# EAGLE design lm3410-sepic-flashlight-driver-17mm-mk-1.0.1 (EAGLE 6.6.0)
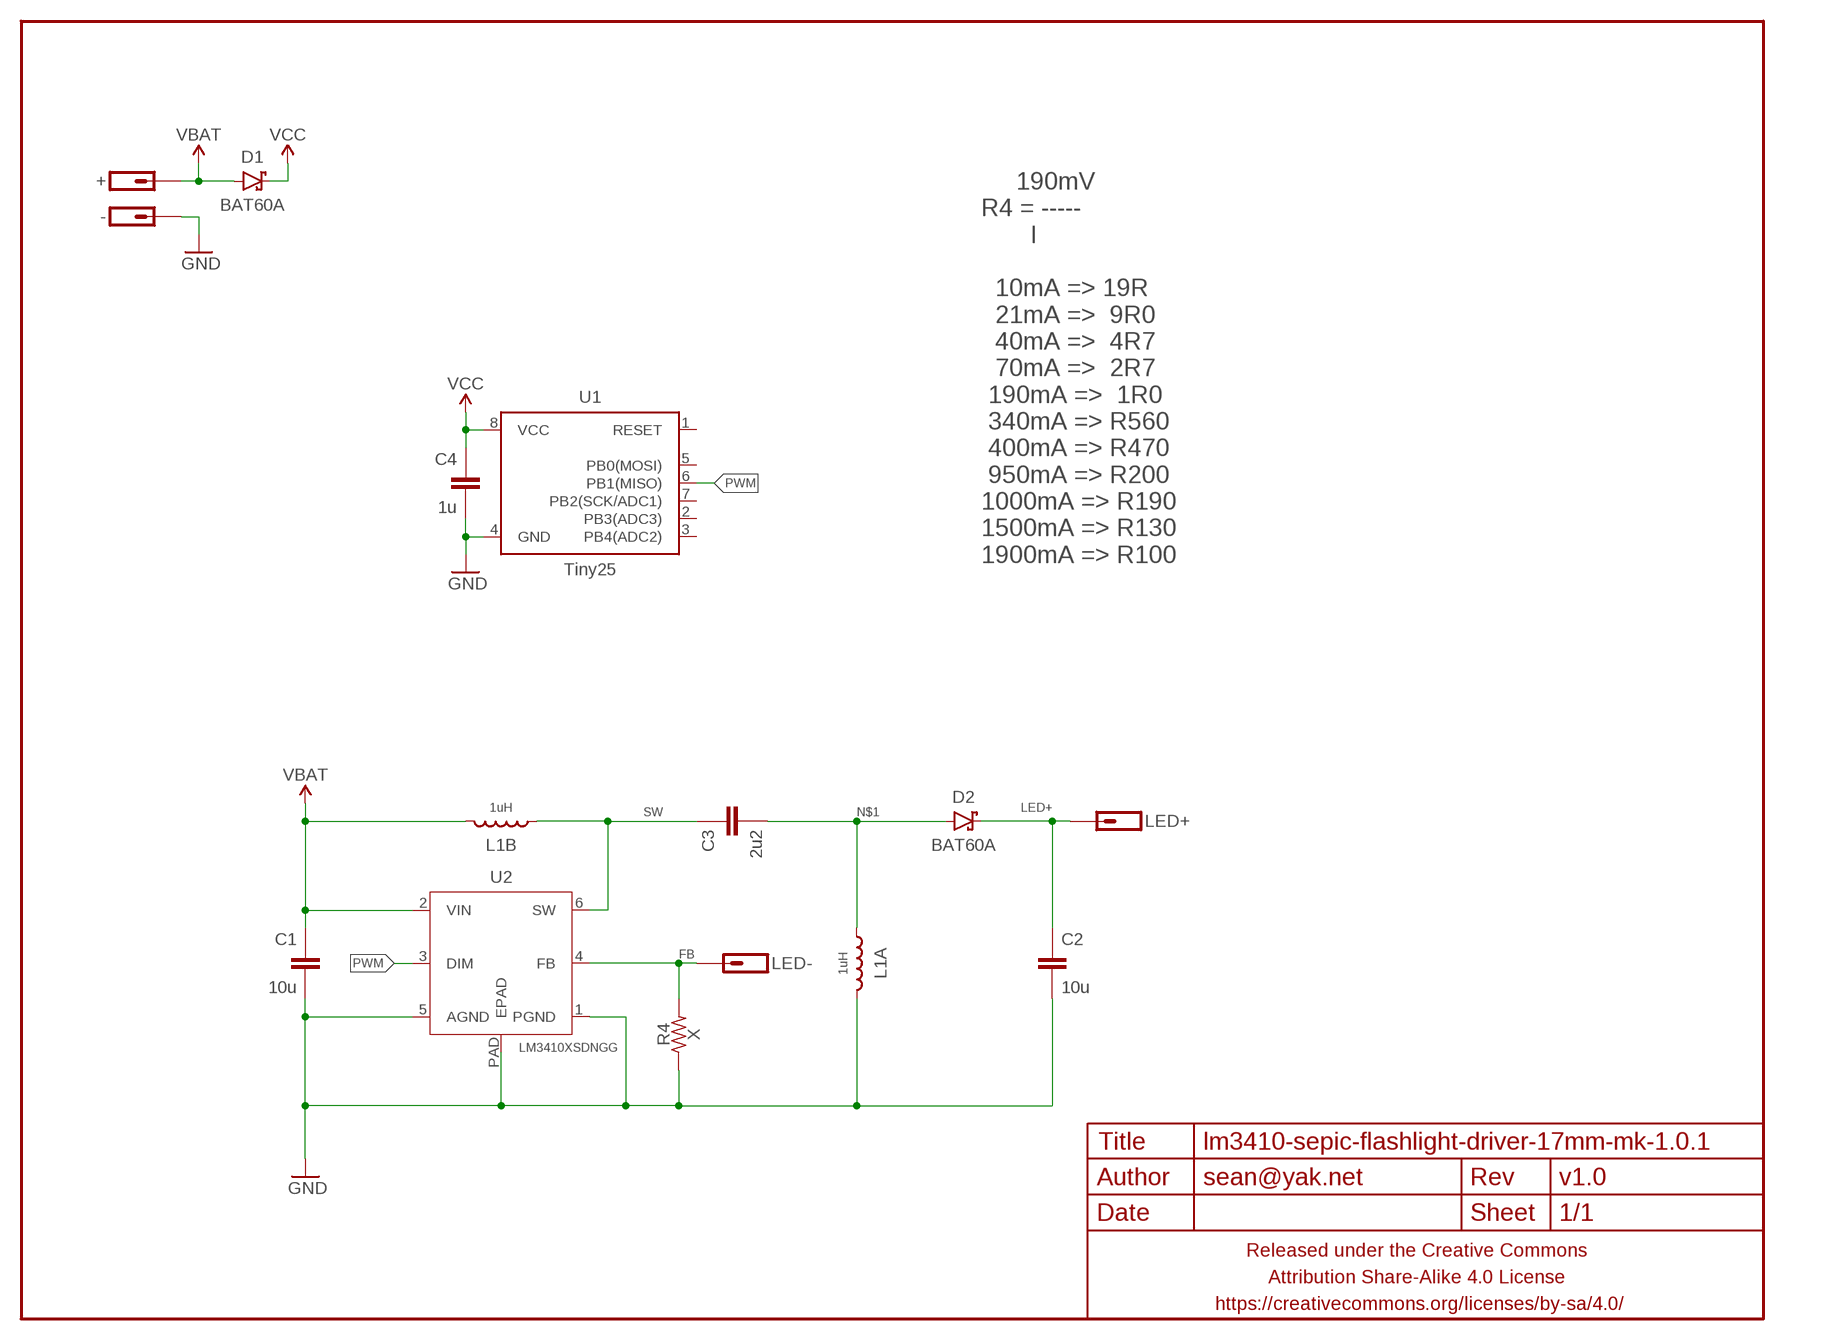
[diagram p0: schematic, sheet 1]

## Parts
+  M01NOT-A-VIA-NOPE  [1X01_NOSILK_NOSTOP]
-  M01NOT-A-VIA-NOPE  [1X01_NOSILK_NOSTOP]
C1  10u  CAPACITOR-CERAMICC0603-TIGHTER  [C0603-TIGHTER]
C2  10u  CAPACITOR-CERAMICC0603-TIGHTER  [C0603-TIGHTER]
C3  2u2  CAPACITOR-CERAMICC0603-TIGHTER  [C0603-TIGHTER]
C4  1u  CAPACITOR-CERAMICC0603-TIGHTER  [C0603-TIGHTER]
D1  BAT60A  DIODE-SCHOTTKYSOD323  [SOD323-SCHOTTKY]
D2  BAT60A  DIODE-SCHOTTKYSOD323  [SOD323-SCHOTTKY]
FRAME1  FRAME-LETTERNO_PACKAGE  [DUMMY]
L1  1uH  INDUCTOR-DUALCOILCRAFT-LPD5030  [LPD5030]
LED+  M01PTH-1MM-CIR-NS  [1X01-1MM-CIR-NS]
LED-  M01PTH-1MM-CIR-NS  [1X01-1MM-CIR-NS]
R4  X  RESISTORR0805-TIGHTER  [R0805-TIGHTER]
U1  Tiny25  ATTINY45TINY25-SOICN-NARROWER  [SO08-SKINNYPADS]
U2  LM3410XSDNGG  [DFN300X300X80-7N]

## Nets
FB: LED-.1 R4.2 U2.4(FB)
GND: -.P$1 C1.2 C2.2 C4.2 L1.2 R4.1 U1.4(GND) U2.1(PGND) U2.5(AGND) U2.PAD(EPAD)
LED+: C2.1 D2.C LED+.1
N$1: C3.2 D2.A L1.1
PWM: U1.6(PB1(MISO)) U2.3(DIM)
SW: C3.1 L1.4 U2.6(SW)
VBAT: +.P$1 C1.1 D1.A L1.3 U2.2(VIN)
VCC: C4.1 D1.C U1.8(VCC)
Unconnected: U1.1(RESET) U1.2(PB3(ADC3)) U1.3(PB4(ADC2)) U1.5(PB0(MOSI)) U1.7(PB2(SCK/ADC1))

## Notes on the sheet
- 190mV
  R4 = -----
         I
  
    10mA => 19R
    21mA =>  9R0
    40mA =>  4R7
    70mA =>  2R7
   190mA =>  1R0
   340mA => R560
   400mA => R470
   950mA => R200
  1000mA => R190
  1500mA => R130
  1900mA => R100

## Library data of the parts
+ - LED+ LED- = a_parts:M01: Header 1 Standard 1-pin 0.1" header. Use with straight break away headers (SKU : PRT-00116), right angle break away headers (PRT-00553), swiss pins (PRT-00743), machine pins (PRT-00117), and female headers (PRT-00115).
C1-C4 = a_parts:CAPACITOR-CERAMIC: CAPACITOR, European symbol
D1 D2 = a_parts:DIODE-SCHOTTKY: Schottky diodes in SFE's production catalog BAT20J 1A 23V 0.62Vf RB751 120mA 40V 0.37Vf PMEG4005EJ 0.5A 40V 0.42Vf MBRA140 1A 40V 0.5Vf B340A 3A 40V SMA
FRAME1 = a_parts:FRAME-LETTER: Schematic Frame Standard 8.5x11 US Letter frame; DESIGNER: sean@yak.net; VERSION: v1.0
L1 = a_parts:INDUCTOR-DUAL
R4 = a_parts:RESISTOR: RESISTOR, American symbol
U1 = a_parts:ATTINY45: Atmel 8-pin 2/4/8kB flash uC
U2 = a_parts:LM3410XSD: Constant Current Boost and SEPIC LED Driver; MPN: LM3410XSD; OC_FARNELL: -; OC_NEWARK: 11N9218; PACKAGE: DFN-6; SUPPLIER: National Semiconductor

## Board
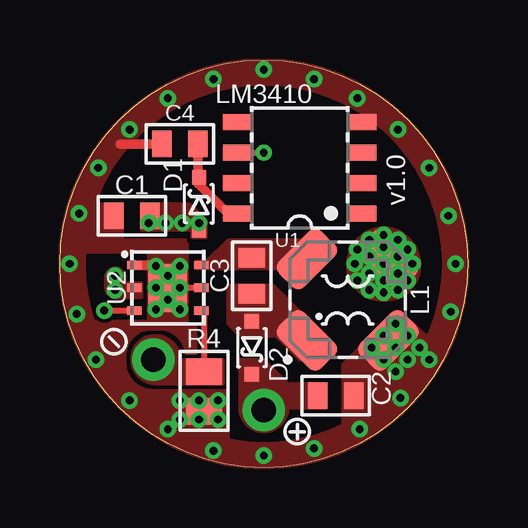
[diagram p1: board, top side]
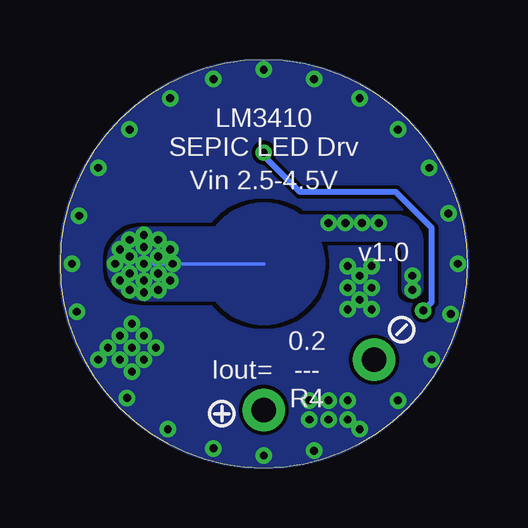
[diagram p2: board, bottom side, seen from below]

Size 17 x 17 mm. Coordinates in mm from the lower left corner, seen from the top.
Outline: 0,8.5 arc-180 17,8.5 arc-180 0,8.5
Copper layers (1*16): Top 0.0356mm / dielectric 1.5011mm / Bottom 0.0356mm
Design rules "LaenPCBOrder2 *": minimum track width 6mil, minimum drill 13mil, track to track 6mil, track to pad 6mil, pad to pad 6mil, via to via 6mil, smd to smd 6mil, copper to edge 0mil, drill to drill 6mil, minimum pad ring 7mil, minimum via ring 7mil, stop-mask expansion 3mil, vias tented up to drill 20mil, thermal gap 10mil

### Footprints (pad centres in the part's own frame; a part is rotated, then mirrored left to right if it is on the bottom)
1X01_NOSILK_NOSTOP = drill 0.33: P$1 0,0
C0603-TIGHTER = smd 0.8 x 1.1: 1 -0.75,0; 2 0.75,0
SOD323-SCHOTTKY = smd 0.6 x 0.6: A -1.1,0; C 1.1,0
LPD5030 = smd 2.5 x 1.5 rotated 45: 1 -1.7,1.7 | smd 2.5 x 1.5 rotated 135: 2 -1.7,-1.7 | smd 2.5 x 1.5 rotated 225: 3 1.7,-1.7 | smd 2.5 x 1.5 rotated 315: 4 1.7,1.7
1X01-1MM-CIR-NS = drill 1.016 pad 1.778: 1 0,0
R0805-TIGHTER = smd 1.1 x 1.5: 1 -0.85,0; 2 0.8,0
SO08-SKINNYPADS = smd 0.65 x 1.2: 1 -1.905,-2.6; 2 -0.635,-2.6; 3 0.635,-2.6; 4 1.905,-2.6; 5 1.905,2.6; 6 0.635,2.6; 7 -0.635,2.6; 8 -1.905,2.6
DFN300X300X80-7N = smd 0.6 x 0.35: 1 -1.4,0.95; 2 -1.4,0; 3 -1.4,-0.95; 4 1.4,-0.95; 5 1.4,0; 6 1.4,0.95 | smd 1.6 x 2: PAD 0,0

### Placement (x,y rotation side)
+  13.5,8.5 180 top
-  0.4,8.5 90 bottom
C1  3,10.5 180 top
C2  11.5,3 0 top
C3  8,8 270 top
C4  5,13.5 180 top
D1  5.8,11 90 top
D2  8,5 270 top
FRAME1  0,0 0 top
L1  12,7 90 top
LED+  8.5,2.4 270 top
LED-  3.9,4.5 180 top
R4  6,3.2 90 top
U1  10,12.5 90 top
U2  4.5,7.5 0 top

### Tracks (layer width: path | path; a pad name or v marks a point on that pad's centre or on a via)
FB
  Top 0.25: U2.4 6,6.55 R4.2
  pour Top (no thermals): 3,4.5 arc-90 3.9,5.5 4,5.5 arc-90 5,4.5 6.8,4.5 6.8,3.5 4,3.5 arc-90
GND  (via drill 0.33)
  Top 0.25: U2.5 v5,7.5
  Top 0.4: C4.2 2.5,13.5
  Top 0.406: U2.1 3.95,8.45 v4,8.4
  other vias: 8.5,0.5 14.2,2.9 8.5,16.6 2.9,14.1 13.5,5.5 5,8.4 4,7.5 5,6.6 4,6.6 4.5,8 4.5,7 5,2.8 6.6,2.8 5.8,2.8 5,2 5.8,2 6.6,2 14,6 13,5 14,4 14.5,5.5 14,5 13.5,4.5 14.5,4.5 15,5 16.5,8.5 14.1,14.1 2.9,2.8 1.5,4.5 4.5,1.6 12.5,1.6 0.7,6.4 6.4,16.2 4.5,15.4 12.4,15.4 15.4,12.5 16.2,10.5 10.6,0.8 15.4,4.5 1.6,12.5 0.8,10.6 10.6,16.2 16.3,6.5 6.4,0.7
  pour Top (isolate 0.152, rank 6, no thermals): 0,8.5 arc90 8.5,0 arc90 17,8.5 16,8.5 arc-90 8.5,1 arc-90 1,8.5
  pour Bottom (isolate 0.152, rank 6, no thermals): 8.5,0 arc-90 0,8.5 arc-90 8.5,17 arc-90 17,8.5 arc-90
  pour Top (isolate 0.152, rank 6, no thermals): 17,8.5 arc90 8.5,17 arc90 0,8.5 1,8.5 arc-90 8.5,16 arc-90 16,8.5
  pour Top (rank 2, no thermals): 1,9 1,11 2.6,11 2.6,9.5 5.3,9.5 5.3,6 6,6 6,3.5 7,3.5 7,1 4.5,1 2,4 1,5.5 1,6.1 3.7,6.1 3.7,9
  pour Top (no thermals): 11.8,1.7 11.8,4.3 14,6.5 14.2,6.5 15.9,4.9 12.5,1.5 12,1.5
LED+
  pour Top (no thermals): 7.5,4.5 8.5,4.5 9.5,3.5 11.1,3.5 11.1,2.5 9.5,2.5 arc-90 8.5,1.5 arc-90 7.5,2.5
N$1
  pour Top (no thermals): 7,7.6 7,6 7.5,5.5 9,5.5 10,4.5 11,4.5 11.5,5 8.9,7.6
PWM  (via drill 0.33)
  Top 0.25: U1.6 v8.5,13.13 | v1.85,6.55 U2.3
  Bottom 0.25: v1.85,6.55 1.5,6.9 1.5,10 3,11.5 7,11.5 8.5,13 v8.5,13.13
SW
  pour Top (no thermals): 5.7,8.6 5.7,8.3 10.5,8.3 10.5,9.5 7,9.5 6.1,8.6
VBAT  (via drill 0.33)
  Bottom 0.152: +.P$1 8.5,8.5
  other vias: 2.3,7.4 12.9,9.5 12.3,8.5 14.1,7.4 14.1,9.5 14.7,8.5 12.9,7.4 3.7,10.2 12.9,8.8 13.5,9.2 14.1,8.8 14.1,8.1 12.9,8.1 13.5,7.8 12.4,9.1 13.5,9.7 14.5,9.1 14.5,7.8 12.4,7.8 13.5,7.3 5.8,10.2 4.4,10.2 5.1,10.2 2.3,8
  pour Bottom (isolate 0.152, no thermals): 6,8.5 arc-180 11,8.5 arc-180
  pour Bottom (no thermals): 13.5,10 arc-90 15,8.5 arc-90 13.5,7 7.5,7 6.5,8 6.5,9.5 3.2,9.5 arc90 2.7,9 2.7,7.5 arc-180 1.9,7.5 1.9,9.4 arc-90 3,10.5 7.5,10.5 8,10
  pour Top (no thermals): 2.4,7.1 arc-90 1.9,7.5 1.9,7.9 arc-90 2.3,8.3 arc-90 2.7,8 2.7,7.7 3.4,7.7 3.4,7.1
  pour Top (no thermals): 3.4,11 5.4,11 6.1,10.3 6.1,9.6 5.5,9.6 5.5,9.9 3.4,9.9
  pour Top (no thermals): 12.8,9.8 arc60 12,8.5 arc60 12.7,7.2 arc60 14.3,7.2 arc60 15,8.5 arc60 14.2,9.8 arc60
VCC
  Top 0.4: D1.C 5.75,11.85 | 5.75,11.85 7,10.6 U1.8 | C4.1 5.75,11.85

### Text on the board
tPlace: LM3410
bPlace: LM3410 / SEPIC LED Drv | Vin 2.5-4.5V | 0.2 / --- / R4 | Iout=